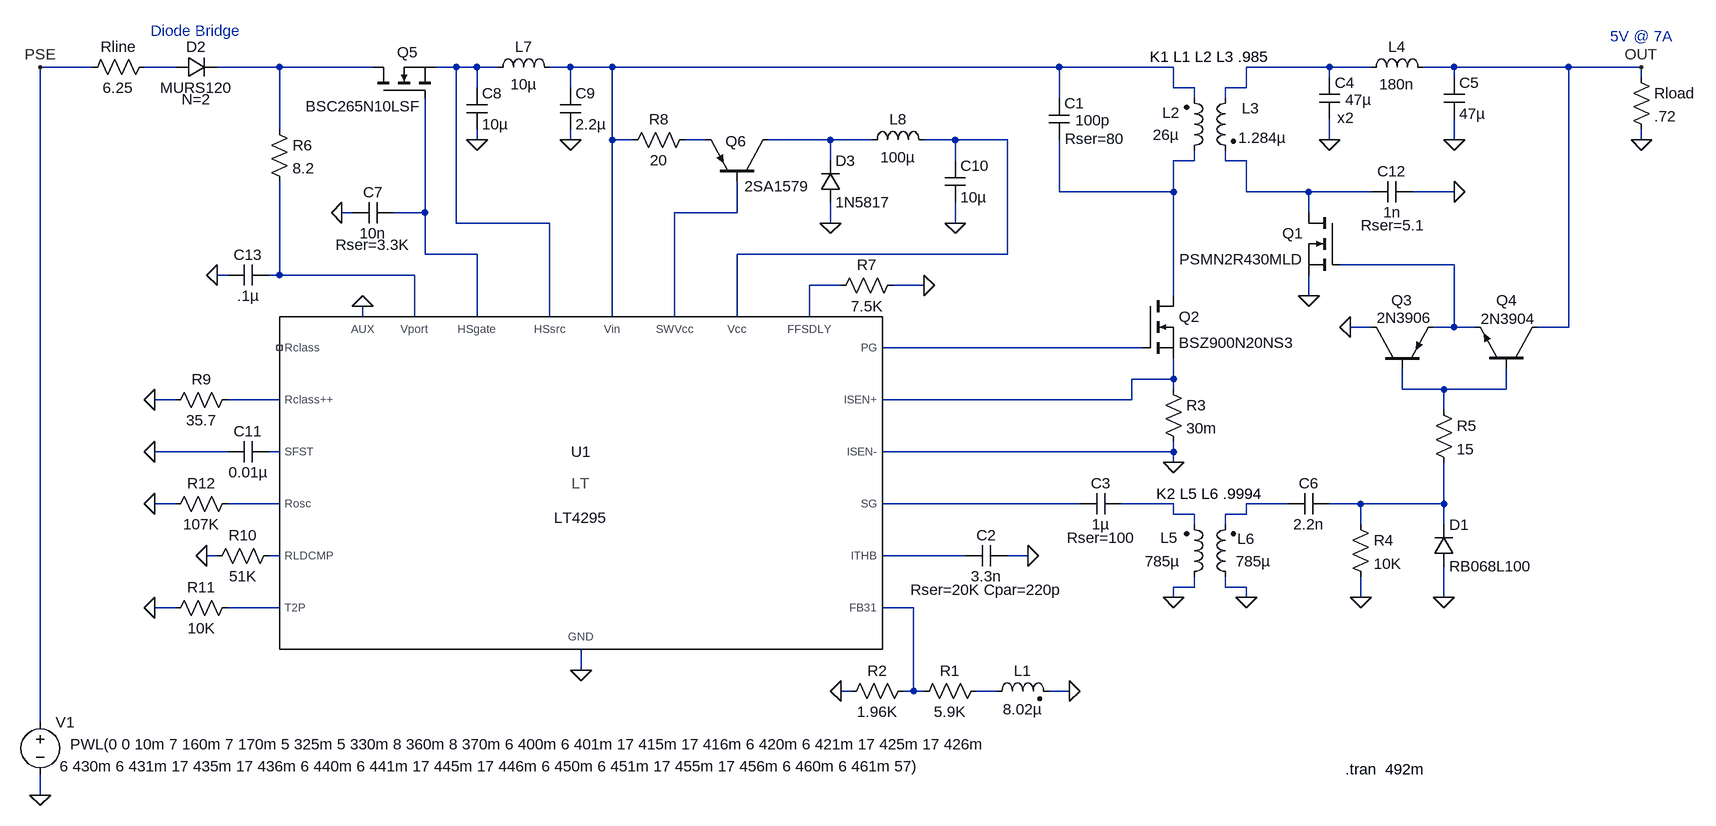
[diagram p0: schematic 4295.asc]
4295.asc, the LTspice schematic file:
Version 4
SHEET 1 6044 680
WIRE 1488 -2464 1408 -2464
WIRE 1616 -2464 1568 -2464
WIRE 1776 -2464 1680 -2464
WIRE 1920 -2464 1776 -2464
WIRE 2048 -2464 2016 -2464
WIRE 2080 -2464 2048 -2464
WIRE 2112 -2464 2080 -2464
WIRE 2224 -2464 2192 -2464
WIRE 2288 -2464 2224 -2464
WIRE 2976 -2464 2288 -2464
WIRE 3152 -2464 2976 -2464
WIRE 3392 -2464 3264 -2464
WIRE 3456 -2464 3392 -2464
WIRE 3584 -2464 3536 -2464
WIRE 3760 -2464 3584 -2464
WIRE 3872 -2464 3760 -2464
WIRE 3392 -2448 3392 -2464
WIRE 3584 -2448 3584 -2464
WIRE 3872 -2448 3872 -2464
WIRE 2080 -2432 2080 -2464
WIRE 2224 -2432 2224 -2464
WIRE 3152 -2432 3152 -2464
WIRE 3184 -2432 3152 -2432
WIRE 3264 -2432 3264 -2464
WIRE 3264 -2432 3232 -2432
WIRE 2976 -2416 2976 -2464
WIRE 3184 -2416 3184 -2432
WIRE 3232 -2416 3232 -2432
WIRE 1776 -2368 1776 -2464
WIRE 2080 -2352 2080 -2368
WIRE 2224 -2352 2224 -2368
WIRE 2288 -2352 2288 -2464
WIRE 2320 -2352 2288 -2352
WIRE 2432 -2352 2400 -2352
WIRE 2624 -2352 2528 -2352
WIRE 2688 -2352 2624 -2352
WIRE 2816 -2352 2768 -2352
WIRE 2896 -2352 2816 -2352
WIRE 3392 -2352 3392 -2384
WIRE 3584 -2352 3584 -2384
WIRE 3872 -2352 3872 -2368
WIRE 2624 -2320 2624 -2352
WIRE 2816 -2320 2816 -2352
WIRE 3184 -2320 3184 -2336
WIRE 3184 -2320 3152 -2320
WIRE 3232 -2320 3232 -2336
WIRE 3264 -2320 3232 -2320
WIRE 2976 -2272 2976 -2352
WIRE 3152 -2272 3152 -2320
WIRE 3152 -2272 2976 -2272
WIRE 3264 -2272 3264 -2320
WIRE 3360 -2272 3264 -2272
WIRE 3456 -2272 3360 -2272
WIRE 3584 -2272 3520 -2272
WIRE 1888 -2240 1872 -2240
WIRE 2000 -2240 2000 -2416
WIRE 2000 -2240 1952 -2240
WIRE 2480 -2240 2480 -2288
WIRE 2480 -2240 2384 -2240
WIRE 3360 -2240 3360 -2272
WIRE 2048 -2224 2048 -2464
WIRE 2192 -2224 2048 -2224
WIRE 2624 -2224 2624 -2256
WIRE 2816 -2224 2816 -2256
WIRE 2000 -2176 2000 -2240
WIRE 2080 -2176 2000 -2176
WIRE 2896 -2176 2896 -2352
WIRE 2896 -2176 2480 -2176
WIRE 3584 -2160 3408 -2160
WIRE 1696 -2144 1680 -2144
WIRE 1776 -2144 1776 -2288
WIRE 1776 -2144 1760 -2144
WIRE 1984 -2144 1776 -2144
WIRE 2640 -2128 2592 -2128
WIRE 2768 -2128 2720 -2128
WIRE 3152 -2112 3152 -2272
WIRE 3360 -2112 3360 -2144
WIRE 1904 -2080 1904 -2096
WIRE 1984 -2080 1984 -2144
WIRE 2080 -2080 2080 -2176
WIRE 2192 -2080 2192 -2224
WIRE 2288 -2080 2288 -2352
WIRE 2384 -2080 2384 -2240
WIRE 2480 -2080 2480 -2176
WIRE 2592 -2080 2592 -2128
WIRE 3456 -2064 3424 -2064
WIRE 3584 -2064 3584 -2160
WIRE 3584 -2064 3552 -2064
WIRE 3616 -2064 3584 -2064
WIRE 3760 -2064 3760 -2464
WIRE 3760 -2064 3712 -2064
WIRE 3104 -2032 2704 -2032
WIRE 3152 -1984 3152 -2016
WIRE 3152 -1984 3088 -1984
WIRE 3152 -1968 3152 -1984
WIRE 3504 -1968 3504 -2000
WIRE 3568 -1968 3504 -1968
WIRE 3664 -1968 3664 -2000
WIRE 3664 -1968 3568 -1968
WIRE 1616 -1952 1584 -1952
WIRE 1776 -1952 1696 -1952
WIRE 3088 -1952 3088 -1984
WIRE 3088 -1952 2704 -1952
WIRE 3568 -1936 3568 -1968
WIRE 1696 -1872 1584 -1872
WIRE 1776 -1872 1760 -1872
WIRE 3152 -1872 3152 -1888
WIRE 3152 -1872 2704 -1872
WIRE 3152 -1856 3152 -1872
WIRE 1616 -1792 1584 -1792
WIRE 1776 -1792 1696 -1792
WIRE 3008 -1792 2704 -1792
WIRE 3152 -1792 3072 -1792
WIRE 3328 -1792 3264 -1792
WIRE 3440 -1792 3392 -1792
WIRE 3568 -1792 3568 -1856
WIRE 3568 -1792 3440 -1792
WIRE 3152 -1776 3152 -1792
WIRE 3184 -1776 3152 -1776
WIRE 3264 -1776 3264 -1792
WIRE 3264 -1776 3232 -1776
WIRE 3184 -1760 3184 -1776
WIRE 3232 -1760 3232 -1776
WIRE 3440 -1760 3440 -1792
WIRE 3568 -1760 3568 -1792
WIRE 1680 -1712 1664 -1712
WIRE 1776 -1712 1760 -1712
WIRE 2832 -1712 2704 -1712
WIRE 2928 -1712 2896 -1712
WIRE 3184 -1664 3184 -1680
WIRE 3184 -1664 3152 -1664
WIRE 3232 -1664 3232 -1680
WIRE 3264 -1664 3232 -1664
WIRE 3152 -1648 3152 -1664
WIRE 3264 -1648 3264 -1664
WIRE 3440 -1648 3440 -1680
WIRE 3568 -1648 3568 -1696
WIRE 1616 -1632 1584 -1632
WIRE 1776 -1632 1696 -1632
WIRE 2752 -1632 2704 -1632
WIRE 2240 -1536 2240 -1568
WIRE 2656 -1504 2640 -1504
WIRE 2752 -1504 2752 -1632
WIRE 2752 -1504 2736 -1504
WIRE 2768 -1504 2752 -1504
WIRE 2880 -1504 2848 -1504
WIRE 2992 -1504 2960 -1504
WIRE 1408 -1456 1408 -2464
WIRE 1408 -1344 1408 -1376
FLAG 3152 -1856 0
FLAG 3872 -2352 0
FLAG 3872 -2464 OUT
FLAG 3568 -1648 0
FLAG 3392 -2352 0
FLAG 3360 -2112 0
FLAG 3424 -2064 0
FLAG 3152 -1648 0
FLAG 3264 -1648 0
FLAG 3440 -1648 0
FLAG 2928 -1712 0
FLAG 2992 -1504 0
FLAG 2640 -1504 0
FLAG 2240 -1536 0
FLAG 3584 -2352 0
FLAG 1408 -2464 PSE
FLAG 1408 -1344 0
FLAG 2624 -2224 0
FLAG 2816 -2224 0
FLAG 2080 -2352 0
FLAG 2224 -2352 0
FLAG 1872 -2240 0
FLAG 2768 -2128 0
FLAG 1584 -1952 0
FLAG 1584 -1872 0
FLAG 1664 -1712 0
FLAG 1584 -1632 0
FLAG 3584 -2272 0
FLAG 1680 -2144 0
FLAG 1584 -1792 0
FLAG 1904 -2096 0
SYMBOL ind2 2864 -1488 R270
WINDOW 0 32 56 VTop 2
WINDOW 3 4 56 VBottom 2
SYMATTR InstName L1
SYMATTR Value 8.02µ
SYMATTR Type ind
SYMATTR Value2 Rser=233m
SYMBOL res 2864 -1520 R90
WINDOW 0 0 56 VBottom 2
WINDOW 3 32 56 VTop 2
SYMATTR InstName R1
SYMATTR Value 5.9K
SYMBOL res 2752 -1520 R90
WINDOW 0 0 56 VBottom 2
WINDOW 3 32 56 VTop 2
SYMATTR InstName R2
SYMATTR Value 1.96K
SYMBOL res 3136 -1984 R0
SYMATTR InstName R3
SYMATTR Value 30m
SYMBOL cap 2960 -2416 R0
WINDOW 3 41 34 Left 2
WINDOW 39 25 62 Left 2
SYMATTR Value 100p
SYMATTR SpiceLine Rser=80
SYMATTR InstName C1
SYMBOL ind2 3168 -2320 M180
WINDOW 0 -6 74 Right 2
WINDOW 3 -7 40 Right 2
SYMATTR InstName L2
SYMATTR Value 26µ
SYMATTR Type ind
SYMATTR Value2 Rser=233m
SYMATTR SpiceLine Rser=94m Rpar=500K
SYMBOL ind2 3248 -2432 M0
WINDOW 0 -9 31 Right 2
WINDOW 3 -4 77 Right 2
SYMATTR InstName L3
SYMATTR Value 1.284µ
SYMATTR Type ind
SYMATTR Value2 Rser=233m
SYMATTR SpiceLine Rser=7m Rpar=500K
SYMBOL nmos 3408 -2240 M0
SYMATTR InstName Q1
SYMATTR Value PSMN2R430MLD
SYMBOL cap 2896 -1728 R90
WINDOW 0 0 32 VBottom 2
WINDOW 3 32 32 VTop 2
WINDOW 39 84 31 VBottom 2
SYMATTR InstName C2
SYMATTR Value 3.3n
SYMATTR SpiceLine Rser=20K Cpar=220p
SYMBOL cap 3072 -1808 R90
WINDOW 0 0 32 VBottom 2
WINDOW 3 32 32 VTop 2
WINDOW 39 84 31 VBottom 2
SYMATTR InstName C3
SYMATTR Value 1µ
SYMATTR SpiceLine Rser=100
SYMBOL nmos 3104 -2112 R0
SYMATTR InstName Q2
SYMATTR Value BSZ900N20NS3
SYMBOL cap 3376 -2448 R0
WINDOW 3 40 34 Left 2
WINDOW 123 28 62 Left 2
SYMATTR Value 47µ
SYMATTR Value2 x2
SYMATTR InstName C4
SYMATTR SpiceLine Rser=25m
SYMBOL ind 3552 -2448 M270
WINDOW 0 32 56 VTop 2
WINDOW 3 5 56 VBottom 2
SYMATTR InstName L4
SYMATTR Value 180n
SYMATTR SpiceLine Rser=5m
SYMBOL cap 3568 -2448 R0
SYMATTR Value 47µ
SYMATTR InstName C5
SYMATTR SpiceLine Rser=50m
SYMBOL ind2 3168 -1664 M180
WINDOW 0 -9 76 Right 2
WINDOW 3 -6 40 Right 2
SYMATTR InstName L5
SYMATTR Value 785µ
SYMATTR Type ind
SYMATTR Value2 Rser=0.6
SYMATTR SpiceLine Rser=0.6
SYMBOL cap 3392 -1808 R90
WINDOW 0 0 32 VBottom 2
WINDOW 3 32 32 VTop 2
SYMATTR InstName C6
SYMATTR Value 2.2n
SYMBOL ind2 3248 -1664 R180
WINDOW 0 -2 74 Right 2
WINDOW 3 0 40 Right 2
SYMATTR InstName L6
SYMATTR Value 785µ
SYMATTR Type ind
SYMATTR Value2 Rser=0.6
SYMATTR SpiceLine Rser=0.6
SYMBOL res 3424 -1776 R0
SYMATTR InstName R4
SYMATTR Value 10K
SYMBOL diode 3552 -1696 M180
WINDOW 0 24 64 Left 2
WINDOW 3 24 0 Left 2
SYMATTR InstName D1
SYMATTR Value RB068L100
SYMBOL res 3552 -1952 R0
SYMATTR InstName R5
SYMATTR Value 15
SYMBOL pnp 3456 -2000 R270
WINDOW 0 105 31 VRight 2
WINDOW 3 78 9 VRight 2
SYMATTR InstName Q3
SYMATTR Value 2N3906
SYMBOL npn 3712 -2000 M270
WINDOW 0 105 63 VLeft 2
WINDOW 3 77 87 VLeft 2
SYMATTR InstName Q4
SYMATTR Value 2N3904
SYMBOL res 1760 -2384 R0
SYMATTR InstName R6
SYMATTR Value 8.2
SYMBOL cap 1952 -2256 R90
WINDOW 3 32 32 VTop 2
WINDOW 39 50 32 VTop 2
WINDOW 0 0 32 VBottom 2
SYMATTR Value 10n
SYMATTR SpiceLine Rser=3.3K
SYMATTR InstName C7
SYMBOL nmos 1920 -2416 R270
WINDOW 0 55 53 VTop 2
WINDOW 3 -12 74 VLeft 2
SYMATTR InstName Q5
SYMATTR Value BSC265N10LSF
SYMBOL diode 1616 -2448 R270
WINDOW 0 32 32 VTop 2
WINDOW 3 0 32 VBottom 2
WINDOW 123 -18 32 VBottom 2
SYMATTR InstName D2
SYMATTR Value MURS120
SYMATTR Value2 N=2
SYMBOL cap 2064 -2432 R0
SYMATTR InstName C8
SYMATTR Value 10µ
SYMATTR SpiceLine Rser=1
SYMBOL ind 2096 -2448 R270
WINDOW 0 32 56 VTop 2
WINDOW 3 5 56 VBottom 2
SYMATTR InstName L7
SYMATTR Value 10µ
SYMATTR SpiceLine Rser=100m
SYMBOL cap 2208 -2432 R0
SYMATTR InstName C9
SYMATTR Value 2.2µ
SYMATTR SpiceLine Rser=5m
SYMBOL res 2736 -2144 R90
WINDOW 0 0 56 VBottom 2
WINDOW 3 32 56 VTop 2
SYMATTR InstName R7
SYMATTR Value 7.5K
SYMBOL res 2416 -2368 R90
WINDOW 0 0 56 VBottom 2
WINDOW 3 32 56 VTop 2
SYMATTR InstName R8
SYMATTR Value 20
SYMBOL pnp 2528 -2288 M270
WINDOW 0 46 49 VTop 2
WINDOW 3 -7 36 VLeft 2
SYMATTR InstName Q6
SYMATTR Value 2SA1579
SYMBOL cap 2800 -2320 R0
SYMATTR InstName C10
SYMATTR Value 10µ
SYMATTR Value2 ic=0
SYMBOL ind 2672 -2336 R270
WINDOW 0 32 56 VTop 2
WINDOW 3 5 56 VBottom 2
SYMATTR InstName L8
SYMATTR Value 100µ
SYMATTR SpiceLine Rser=5m
SYMBOL diode 2608 -2256 M180
WINDOW 0 24 64 Left 2
WINDOW 3 24 0 Left 2
SYMATTR InstName D3
SYMATTR Value 1N5817
SYMBOL res 1712 -1968 R90
WINDOW 0 0 56 VBottom 2
WINDOW 3 32 56 VTop 2
SYMATTR InstName R9
SYMATTR Value 35.7
SYMBOL cap 1760 -1888 R90
WINDOW 0 0 32 VBottom 2
WINDOW 3 32 32 VTop 2
SYMATTR InstName C11
SYMATTR Value 0.01µ
SYMBOL res 1776 -1728 R90
WINDOW 0 0 56 VBottom 2
WINDOW 3 32 56 VTop 2
SYMATTR InstName R10
SYMATTR Value 51K
SYMBOL voltage 1408 -1472 R0
WINDOW 3 46 50 Left 2
WINDOW 123 30 84 Left 2
SYMATTR Value PWL(0 0 10m 7 160m 7 170m 5 325m 5 330m 8 360m 8 370m 6 400m 6 401m 17 415m 17 416m 6 420m 6 421m 17 425m 17 426m
SYMATTR Value2 6 430m 6 431m 17 435m 17 436m 6 440m 6 441m 17 445m 17 446m 6 450m 6 451m 17 455m 17 456m 6 460m 6 461m 57)
SYMATTR InstName V1
SYMBOL res 1712 -1648 R90
WINDOW 0 0 56 VBottom 2
WINDOW 3 32 56 VTop 2
SYMATTR InstName R11
SYMATTR Value 10K
SYMBOL cap 3520 -2288 R90
WINDOW 0 0 32 VBottom 2
WINDOW 3 32 32 VTop 2
WINDOW 39 83 30 VBottom 2
SYMATTR InstName C12
SYMATTR Value 1n
SYMATTR SpiceLine Rser=5.1
SYMBOL cap 1760 -2160 R90
WINDOW 0 0 32 VBottom 2
WINDOW 3 32 32 VTop 2
SYMATTR InstName C13
SYMATTR Value .1µ
SYMBOL res 1712 -1808 R90
WINDOW 0 0 56 VBottom 2
WINDOW 3 32 56 VTop 2
SYMATTR InstName R12
SYMATTR Value 107K
SYMBOL LT4295 2240 -1824 R0
SYMATTR InstName U1
SYMBOL res 1584 -2480 R90
WINDOW 0 0 56 VBottom 2
WINDOW 3 32 56 VTop 2
SYMATTR InstName Rline
SYMATTR Value 6.25
SYMBOL res 3856 -2464 R0
SYMATTR InstName Rload
SYMATTR Value .72
TEXT 3416 -1384 Left 2 !.tran  492m
TEXT 3208 -2464 Bottom 2 !K1 L1 L2 L3 .985
TEXT 3872 -2496 Bottom 2 ;5V @ 7A
TEXT 3208 -1792 Bottom 2 !K2 L5 L6 .9994
TEXT 1648 -2504 Bottom 2 ;Diode Bridge

The netlist it stands for:
* 4295.asc
L1 N030 0 8.02µ Rser=233m
R1 N030 N029 5.9K
R2 N029 0 1.96K
R3 N017 0 30m
C1 N004 N009 100p Rser=80
L2 N009 N004 26µ Rser=233m Rser=94m Rpar=500K
L3 N005 N010 1.284µ Rser=233m Rser=7m Rpar=500K
M§Q1 N010 N013 0 0 PSMN2R430MLD
C2 0 N027 3.3n Rser=20K Cpar=220p
C3 N023 N022 1µ Rser=100
M§Q2 N009 N016 N017 N017 BSZ900N20NS3
C4 N005 0 47µ x2 Rser=25m
L4 OUT N005 180n Rser=5m
C5 OUT 0 47µ Rser=50m
L5 0 N023 785µ Rser=0.6 Rser=0.6
C6 N025 N024 2.2n
L6 0 N024 785µ Rser=0.6 Rser=0.6
R4 N025 0 10K
D1 0 N025 RB068L100
R5 N018 N025 15
Q3 0 N018 N013 0 2N3906
Q4 OUT N018 N013 0 2N3904
R6 N002 N014 8.2
C7 N011 0 10n Rser=3.3K
M§Q5 N002 N011 N003 N003 BSC265N10LSF
D2 N001 N002 MURS120 N=2
C8 N003 0 10µ Rser=1
L7 N003 N004 10µ Rser=100m
C9 N004 0 2.2µ Rser=5m
R7 0 N015 7.5K
R8 N006 N004 20
Q6 N007 N012 N006 0 2SA1579
C10 N008 0 10µ ic=0
L8 N007 N008 100µ Rser=5m
D3 0 N007 1N5817
R9 N019 0 35.7
C11 N020 0 0.01µ
R10 N026 0 51K
V1 PSE 0 PWL(0 0 10m 7 160m 7 170m 5 325m 5 330m 8 360m 8 370m 6 400m 6 401m 17 415m 17 416m 6 420m 6 421m 17 425m 17 426m 6 430m 6 431m 17 435m 17 436m 6 440m 6 441m 17 445m 17 446m 6 450m 6 451m 17 455m 17 456m 6 460m 6 461m 57)
R11 N028 0 10K
C12 0 N010 1n Rser=5.1
C13 N014 0 .1µ
R12 N021 0 107K
XU1 0 0 N019 NC_01 N028 N008 N021 N020 N015 N027 N029 N026 0 N017 N022 N016 N012 N004 N003 N011 N014 LT4295  ; pins GND AUX Rclass++ Rclass T2P Vcc Rosc SFST FFSDLY ITHB FB31 RLDCMP ISEN- ISEN+ SG PG SWVcc Vin HSsrc HSgate Vport
Rline N001 PSE 6.25
Rload OUT 0 .72
.model D D
.lib standard.dio
.model NPN NPN
.model PNP PNP
.lib standard.bjt
.model NMOS NMOS
.model PMOS PMOS
.lib standard.mos
.tran  492m
K1 L1 L2 L3 .985
* 5V @ 7A
K2 L5 L6 .9994
* Diode Bridge
.lib LT4295.sub
.backanno
.end